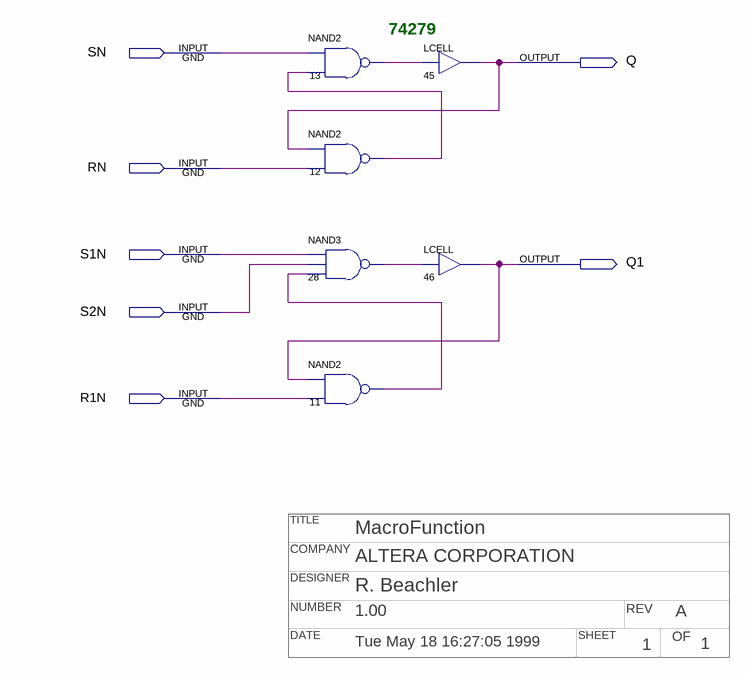
[diagram p0: schematic sheet]
// Quartus schematic 74279m.bdf as structural Verilog: 6 symbols, 7 pins
// Title block: TITLE: MacroFunction; COMPANY: ALTERA CORPORATION; DESIGNER: R. Beachler; NUMBER: 1.00; REV: A; DATE: Tue May 18 16:27:05 1999; SHEET: 1; OF: 1
module \74279m  (
  input  SN,
  input  RN,
  input  S1N,
  input  S2N,
  input  R1N,
  output Q,
  output Q1
);

  wire n11_out, n12_out, n13_out, n28_out;

  nand u_13 (n13_out, SN, n12_out);
  nand u_12 (n12_out, Q, RN);
  nand u_28 (n28_out, S1N, S2N, n11_out);
  nand u_11 (n11_out, Q1, R1N);
  LCELL u_45 (.IN(n13_out), .OUT(Q));
  LCELL u_46 (.IN(n28_out), .OUT(Q1));

  // Notes on the sheet:
  //   74279
endmodule
